# EAGLE design batteryholder2S4P_revD (EAGLE 9.5.1)

## Sheet 1 of 2
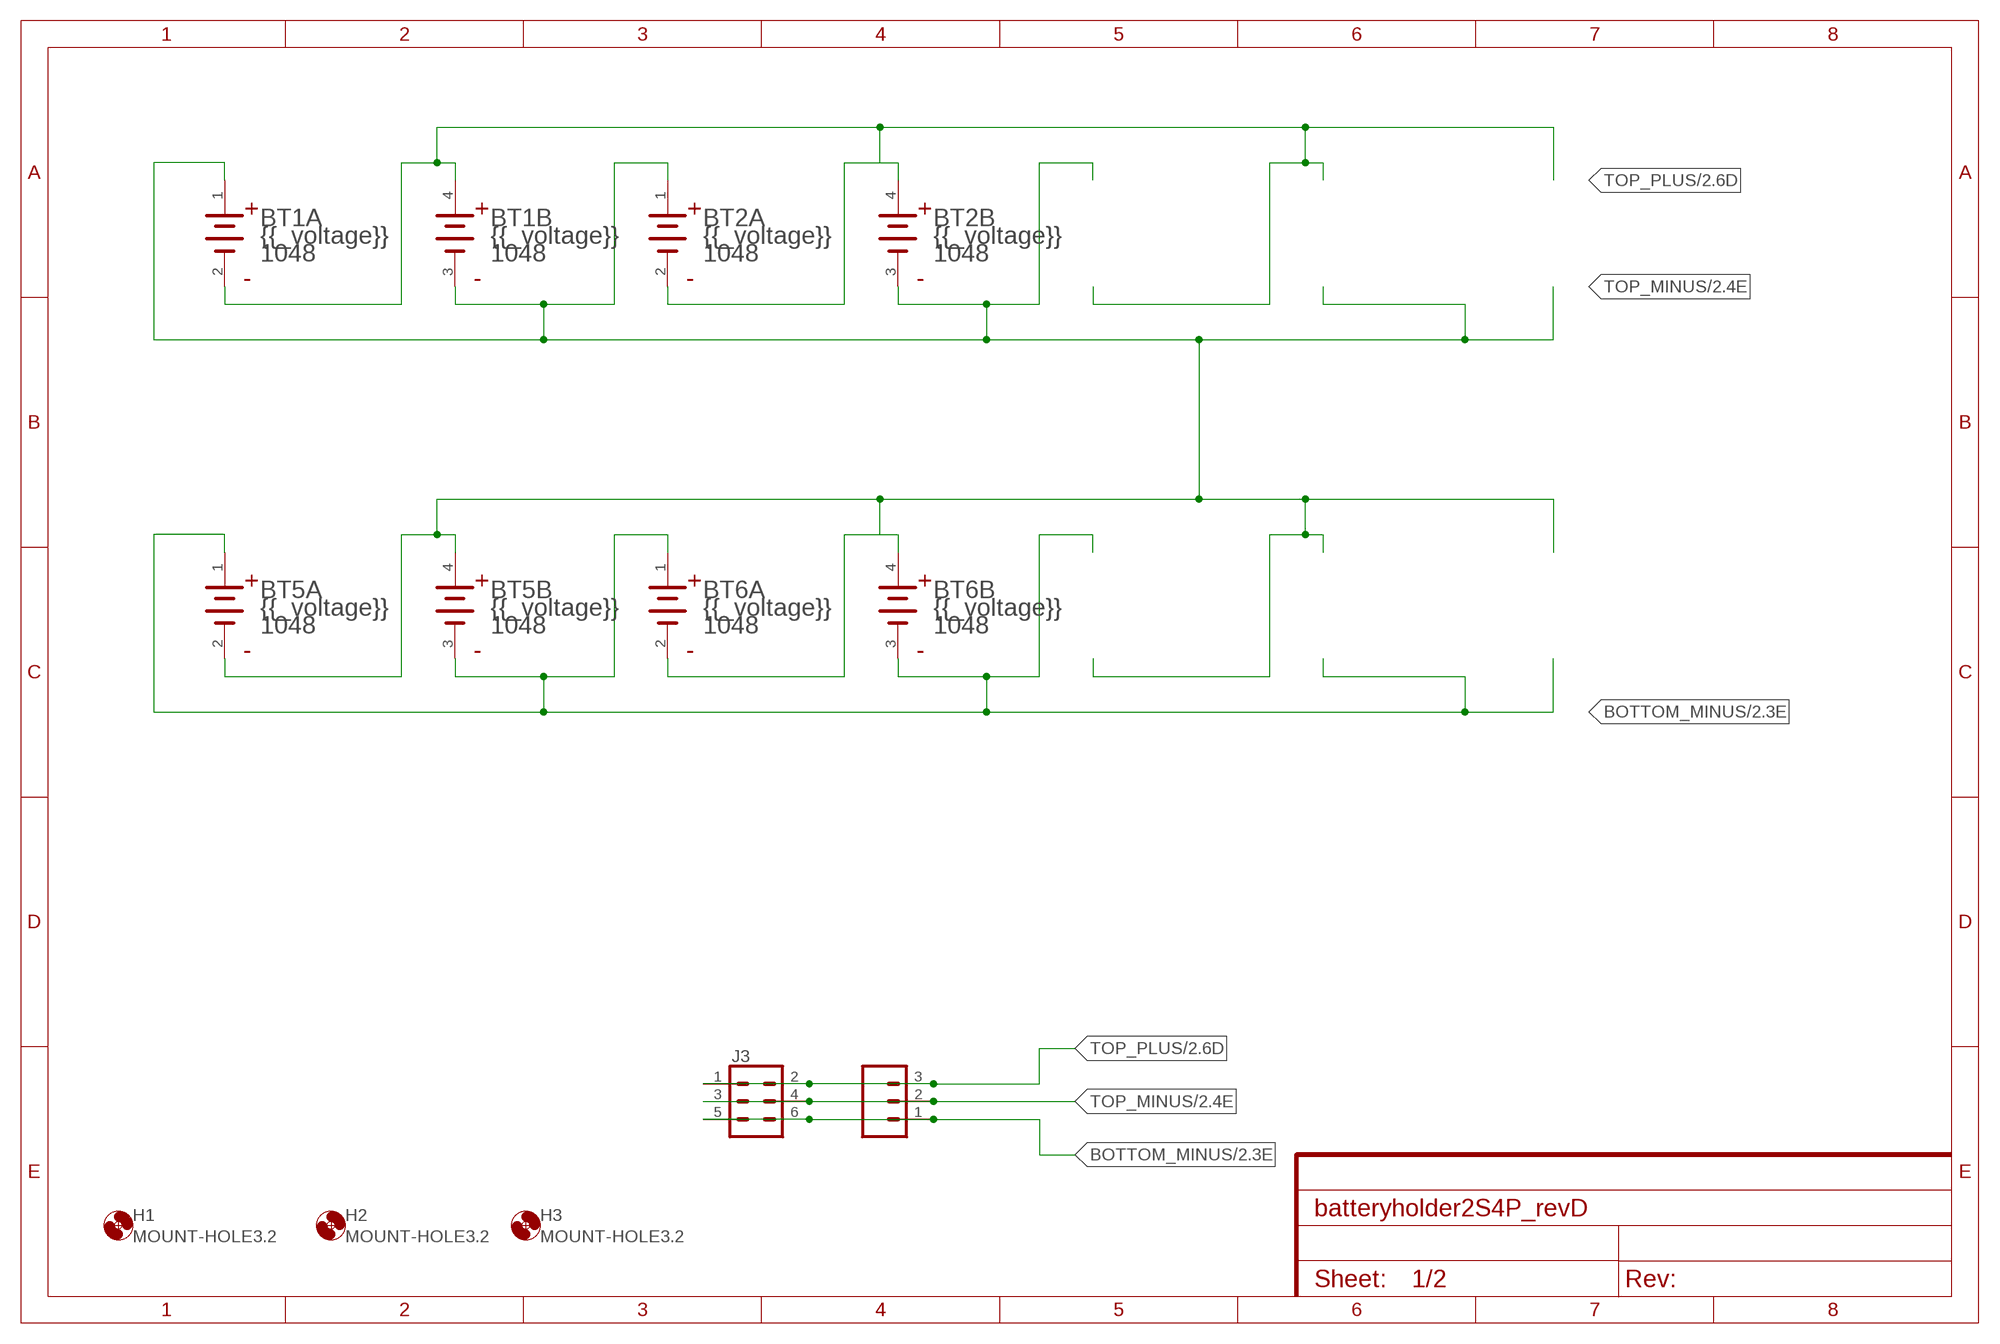
[diagram p0: schematic, sheet 1]

### Parts
BT1  KEYSTONE_1048KEYSTONE_1048_0_0  [KEYSTONE_1048_0]
BT2  KEYSTONE_1048KEYSTONE_1048_0_0  [KEYSTONE_1048_0]
BT5  KEYSTONE_1048KEYSTONE_1048_0_0  [KEYSTONE_1048_0]
BT6  KEYSTONE_1048KEYSTONE_1048_0_0  [KEYSTONE_1048_0]
H1  MOUNT-HOLE3.2  [3,2]
H2  MOUNT-HOLE3.2  [3,2]
H3  MOUNT-HOLE3.2  [3,2]
J1  CONN_03-SCREW-5MM  [SCREWTERMINAL-5MM-3]
J3  CONN_03X2SHROUD  [2X3-SHROUDED]

### Nets
BOTTOM_MINUS: BT5.1(A:1_ANODE) BT5.3(B:2_CATHODE) BT6.1(A:1_ANODE) BT6.3(B:2_CATHODE) J1.1 J3.5 J3.6 ; also sheet 2
TOP_MINUS: BT1.1(A:1_ANODE) BT1.3(B:2_CATHODE) BT2.1(A:1_ANODE) BT2.3(B:2_CATHODE) BT5.2(A:1_CATHODE) BT5.4(B:2_ANODE) BT6.2(A:1_CATHODE) BT6.4(B:2_ANODE) J1.2 J3.3 J3.4 ; also sheet 2
TOP_PLUS: BT1.2(A:1_CATHODE) BT1.4(B:2_ANODE) BT2.2(A:1_CATHODE) BT2.4(B:2_ANODE) J1.3 J3.1 J3.2 ; also sheet 2

## Sheet 2 of 2
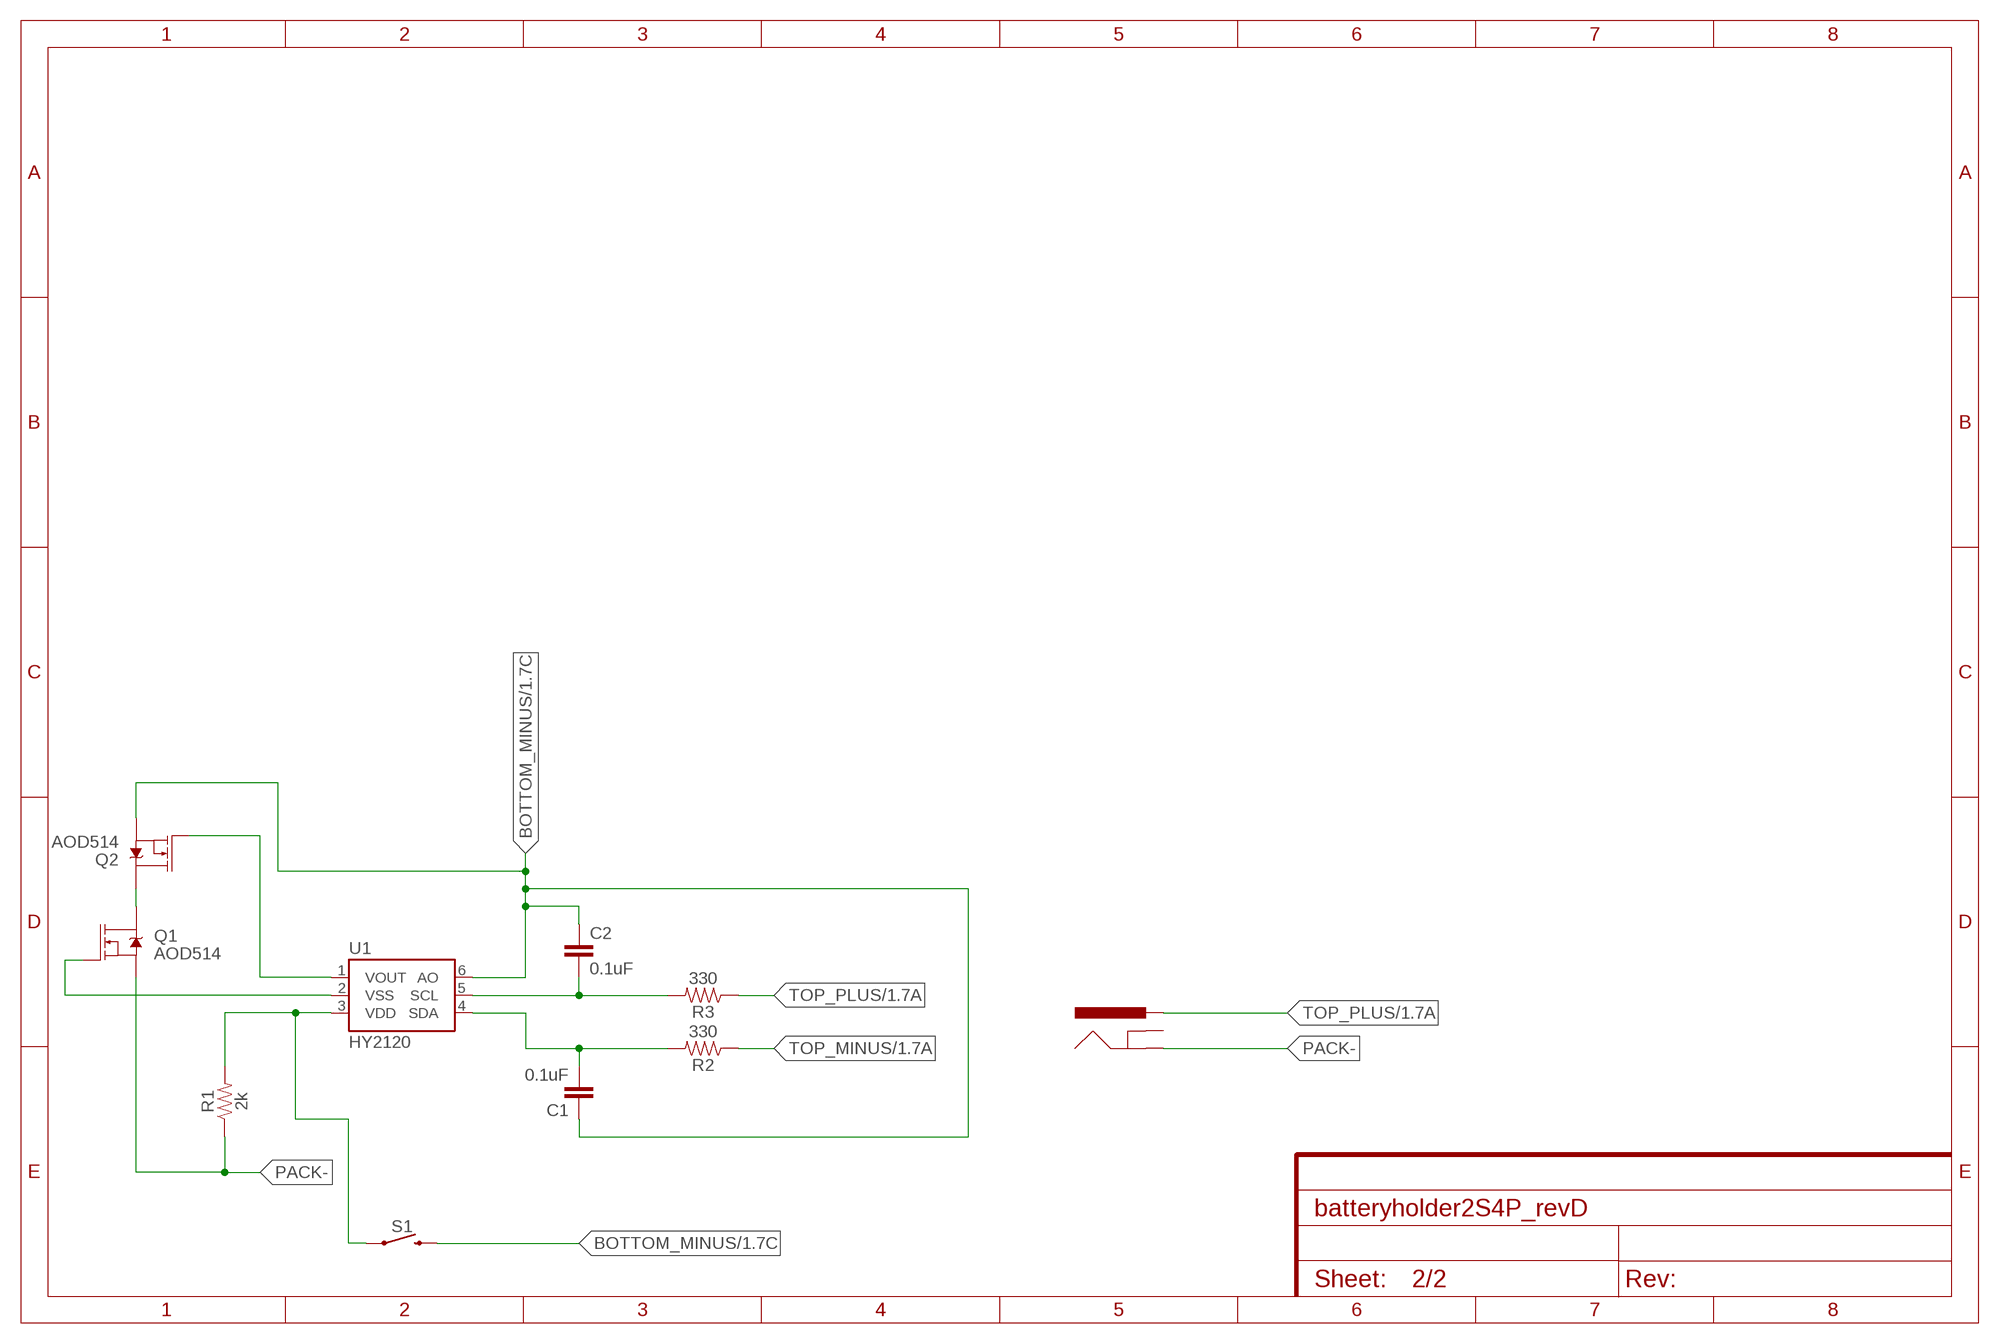
[diagram p1: schematic, sheet 2]

### Parts
C1  0.1uF  1.0UF-1206-50V-10%  [1206]
C2  0.1uF  1.0UF-1206-50V-10%  [1206]
J2  POWER_JACKPTH_BREAD  [POWER_JACK_PTH_BREAD]
Q1  AOD514  MOSFET-NCH-FDD8780  [DPAK]
Q2  AOD514  MOSFET-NCH-FDD8780  [DPAK]
R1  2k  RESISTOR1206  [1206]
R2  330  RESISTOR1206  [1206]
R3  330  RESISTOR1206  [1206]
S1  MOMENTARY-SWITCH-SPST-PTH-6.0MM  [TACTILE_SWITCH_PTH_6.0MM]
U1  HY2120  MCP4725SOT-23  [SOT23-6]

### Nets
BOTTOM_MINUS: C1.1 C2.1 Q2.3(S) S1.3 U1.6(AO) ; also sheet 1
N$1: Q2.1(G) U1.1(VOUT)
N$2: Q1.1(G) U1.2(VSS)
N$3: R1.2 S1.1 U1.3(VDD)
N$4: C2.2 R3.2 U1.5(SCL)
N$5: C1.2 R2.2 U1.4(SDA)
N$6: Q1.4(D) Q2.4(D)
PACK-: J2.GND Q1.3(S) R1.1
TOP_MINUS: R2.1 ; also sheet 1
TOP_PLUS: J2.PWR R3.1 ; also sheet 1
Unconnected: J2.GNDBREAK

## Library data of the parts
BT1 BT2 BT5 BT6 = Keystone - 1048:KEYSTONE_1048: SMT Holder for Dual 18650 Batteries; CENTROID_NOT_SPECIFIED: No; CONN_ORIENTATION: Horizontal; CONTACT_MATERIAL: Gold,Nickel; DATASHEET: https://www.keyelco.com/userAssets/file/M65p27.pdf; DEVICE_CLASS_L1: Connectors; DEVICE_CLASS_L2: unset; DEVICE_CLASS_L3: unset; DIGIKEY_DESCRIPTION: BATT HOLDER 18650 2 CELL SMD TAB; DIGIKEY_PART_NUMBER: 36-1048-ND; FOOTPRINT_URL: https://www.keyelco.com/product-pdf.cfm?p=920; HEIGHT: 0.595inch; LEAD_FREE: yes; MF: Keystone; MFG_PACKAGE_IDENT: 1048; MFG_PACKAGE_IDENT_DATE: 0; MFG_PACKAGE_IDENT_REV: 0; MOUSER_DESCRIPTION: Battery holder SMD Dimensions L x W x H: 86 x 39.78 x 14.86 mm Suitable for: 2 x 18650; MOUSER_PART_NUMBER: 534-1048; MPN: 1048; NUMBER_OF_CONTACTS: 2; PACKAGE: SMT_BTTHLDR_18650_DUAL; PREFIX: BT; ROHS: yes; TEMPERATURE_RANGE_HIGH: +145°C; TEMPERATURE_RANGE_LOW: -50°C; VERIFICATION_VERSION: 0.0.0.1
C1 C2 = SparkFun-Capacitors:1.0UF: 1µF ceramic capacitors A capacitor is a passive two-terminal electrical component used to store electrical energy temporarily in an electric field.; PROD_ID: CAP-09822; VALUE: 1.0uF
H1-H3 = holes:MOUNT-HOLE: MOUNTING HOLE with drill center marker
J1 = SparkFun-Connectors:CONN_03: Multi connection point. Often used as Generic Header-pin footprint for 0.1 inch spaced/style header connections On any of the 0.1 inch spaced packages, you can populate with these: Break Away Headers - Straight <https://www.sparkfun.com/products/116> (PRT-00116) Break Away Male Headers - Right Angle <https://www.sparkfun.com/products/553> (PRT-00553) Female Headers <https://www.sparkfun.com/products/115> (PRT-00115) Break Away Headers - Machine Pin <https://www.sparkfun.com/products/117> (PRT-00117) Break Away Female Headers - Swiss Machine Pin <https://www.sparkfun.com/products/743> (PRT-00743) Stackable Header - 3 Pin (Female, 0.1") <https://www.sparkfun.com/products/13875> (PRT-13875) For SCREWTERMINALS and SPRING TERMINALS visit here: Screw Terimnals on SparkFun.com <https://www.sparkfun.com/search/results?term=Screw+Terminals> (5mm/3.5mm/2.54mm spacing) This device is also useful as a general connection point to wire up your design to another part of your project. Our various solder wires solder well into these plated through hole pads. Hook-Up Wire - Assortment (Stranded, 22 AWG) <https://www.sparkfun.com/products/11375> (PRT-11375) Hook-Up Wire - Assortment (Solid Core, 22 AWG) <https://www.sparkfun.com/products/11367> (PRT-11367) View the entire wire category on our website here <https://www.sparkfun.com/categories/141> Special notes: Molex polarized connector foot print use with SKU : PRT-08232 with associated crimp pins and housings.; PROD_ID: CONN-10134; SF_SKU: PRT-08433
J2 = SparkFun-Connectors:POWER_JACK: Power Jack Connector This is the standard 5.5mm barrel jack for power. The PTH is the most common, proven, reliable, footprint. The Slot footprint only works if the mill layer is transmitted to the PCB fab house so be warned. Here are the connectors we sell at SparkFun: DC Barrel Power Jack/Connector <https://www.sparkfun.com/products/119> (PRT-00119) DC Barrel Power Jack/Connector (SMD) <https://www.sparkfun.com/products/12748> (PRT-12748) DC Barrel Jack Adapter - Breadboard Compatible <https://www.sparkfun.com/products/10811> (PRT-10811) It is used on this SparkFun product (and many, many others): SparkFun RedBoard - Programmed with Arduino <https://www.sparkfun.com/products/12757> (DEV-12757) Also, if you need a mating power supply or connector, please check these out: Wall Adapter Power Supply - 9VDC 650mA <https://www.sparkfun.com/products/298> (TOL-00298) DC Barrel Jack Adapter - Male <https://www.sparkfun.com/products/10287> (PRT-10287); PROD_ID: PRT-10811
J3 = SparkFun-Connectors:CONN_03X2: Multi connection point. Often used as Generic Header-pin footprint for 0.1 inch spaced/style header connections You can populate with any combo of single row headers, but if you'd like an exact match, check these: Header - 2x3 (Male, 0.1") <https://www.sparkfun.com/products/12807> (PRT-12807) Header - 2x3 (Female, 0.1") <https://www.sparkfun.com/products/13010> (PRT-13010) 2x3 Pin Shrouded Header <https://www.sparkfun.com/products/10877> (PRT-10877) On any of the 0.1 inch spaced packages, you can populate with these: Break Away Headers - Straight <https://www.sparkfun.com/products/116> (PRT-00116) Break Away Male Headers - Right Angle <https://www.sparkfun.com/products/553> (PRT-00553) Female Headers <https://www.sparkfun.com/products/115> (PRT-00115) Break Away Headers - Machine Pin <https://www.sparkfun.com/products/117> (PRT-00117) Break Away Female Headers - Swiss Machine Pin <https://www.sparkfun.com/products/743> (PRT-00743) Special note: the shrouded connector mates well with our 3x2 ribbon cables: Ribbon Crimp Connector - 6-pin (2x3, Female) <https://www.sparkfun.com/products/10651> (PRT-10651) Ribbon Cable - 6 wire (15ft) <https://www.sparkfun.com/products/10646> (PRT-10646); PROD_ID: CONN-10681; SF_ID: PRT_10877
Q1 Q2 = SparkFun-DiscreteSemi:MOSFET-NCH: N-channel MOSFETs Voltage controlled devices that allow control of high current outputs. SparkFun Products: SparkFun OpenScale <https://www.sparkfun.com/products/13261> SparkFun Digital Sandbox <https://www.sparkfun.com/products/12651> SparkFun Monster Moto Shield <https://www.sparkfun.com/products/10182> SparkFun MOSFET Power Controller <https://www.sparkfun.com/products/11214>; PROD_ID: TRANS-09984; VALUE: 35A/25V/8.5mΩ
R1-R3 = SparkFun-Resistors:RESISTOR: Generic Resistor Package
S1 = SparkFun-Switches:MOMENTARY-SWITCH-SPST: Momentary Switch (Pushbutton) - SPST Normally-open (NO) SPST momentary switches (buttons, pushbuttons). Variants PTH-12MM - 12mm square, through-hole Momentary Pushbutton Switch - 12mm Square <https://www.sparkfun.com/products/9190> (COM-09190) PTH-6.0MM, PTH-6.0MM-KIT - 6.0mm square, through-hole Mini Pushbutton Switch <https://www.sparkfun.com/products/97> (COM-00097) KIT package intended for soldering kit's - only one side of pads' copper is exposed. PTH-RIGHT-ANGLE-KIT - Right-angle, through-hole Right Angle Tactile Button <https://www.sparkfun.com/products/10791> - Used on SparkFun BigTime Watch Kit <https://www.sparkfun.com/products/11734> SMD-12MM - 12mm square, surface-mount Tactile Button - SMD (12mm) <https://www.sparkfun.com/products/12993> (COM-12993) Used on SparkFun PicoBoard <https://www.sparkfun.com/products/11888> SMD-4.5MM - 4.5mm Square Trackball Switch Used on SparkFun Blackberry Trackballer Breakout <https://www.sparkfun.com/products/13169> SMD-4.6MMX2.8MM - 4.60mm x 2.80mm, surface mount Used on SparkFun SAMD21 Mini Breakout <https://www.sparkfun.com/products/13664> SMD-5.2MM, SMD-5.2-REDUNDANT - 5.2mm square, surface-mount Mini Pushbutton Switch - SMD <https://www.sparkfun.com/products/8720> (COM-08720) Used on Arduino Pro Mini <https://www.sparkfun.com/products/11114> REDUNDANT package connects both switch circuits together SMD-6.0X3.5MM - 6.0 x 3.5mm, surface mount Momentary Reset Switch SMD <https://www.sparkfun.com/products/8229> (COM-08229) SMD-6.2MM-TALL - 6.2mm square, surface mount Tactile Button - SMD (6mm) <https://www.sparkfun.com/products/12992> Used on SparkFun Digital Sandbox <https://www.sparkfun.com/products/12651> SMD-RIGHT-ANGLE - Right-angle, surface mount Used on SparkFun Block for Intel® Edison - Arduino <https://www.sparkfun.com/products/13036>; PROD_ID: SWCH-08441; SF_SKU: COM-00097
U1 = SparkFun-IC-Conversion:MCP4725: MCP4725 DAC Microchip 12-bit I2C DAC, SOT23-6 Datasheet <https://cdn.sparkfun.com/datasheets/BreakoutBoards/MCP4725_2009.pdf> SparkFun Products SparkFun I2C DAC Breakout - MCP4725 <https://www.sparkfun.com/products/12918> (BOB-12918); PROD_ID: IC-08886; VALUE: MCP4725

## Board
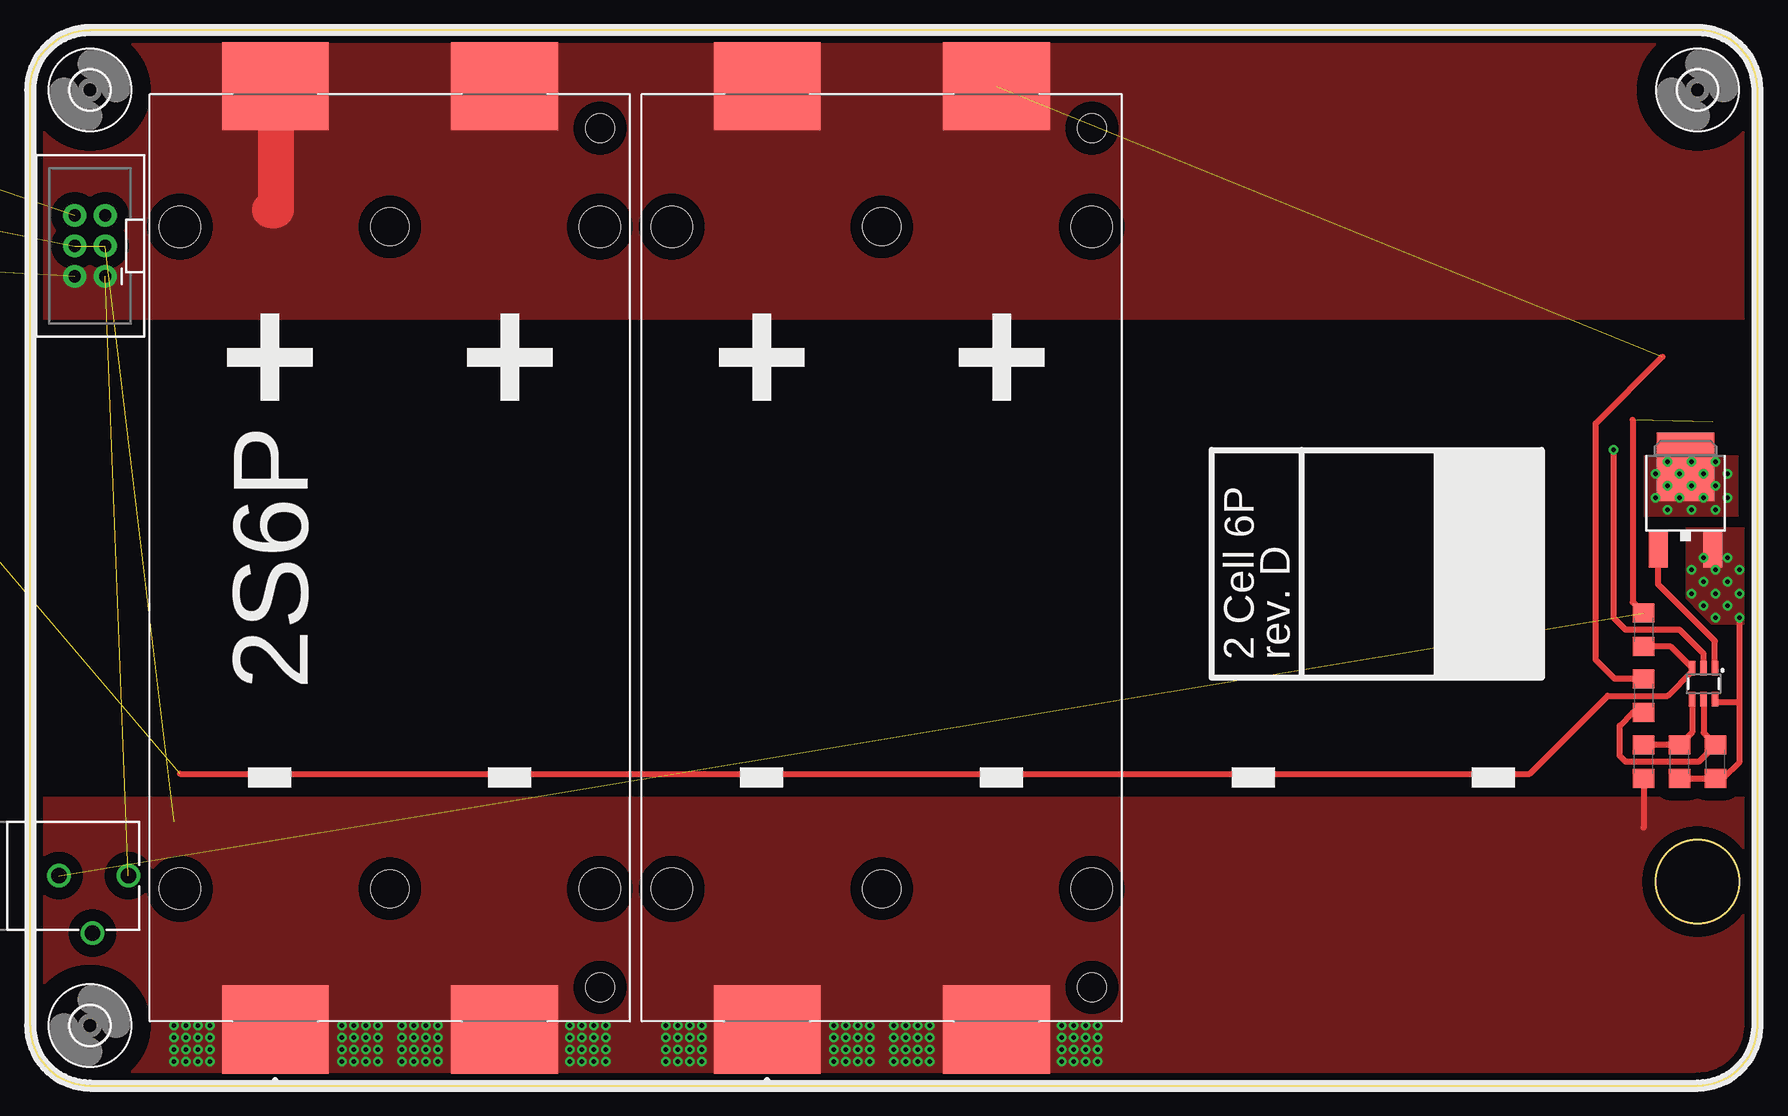
[diagram p2: board, top side]
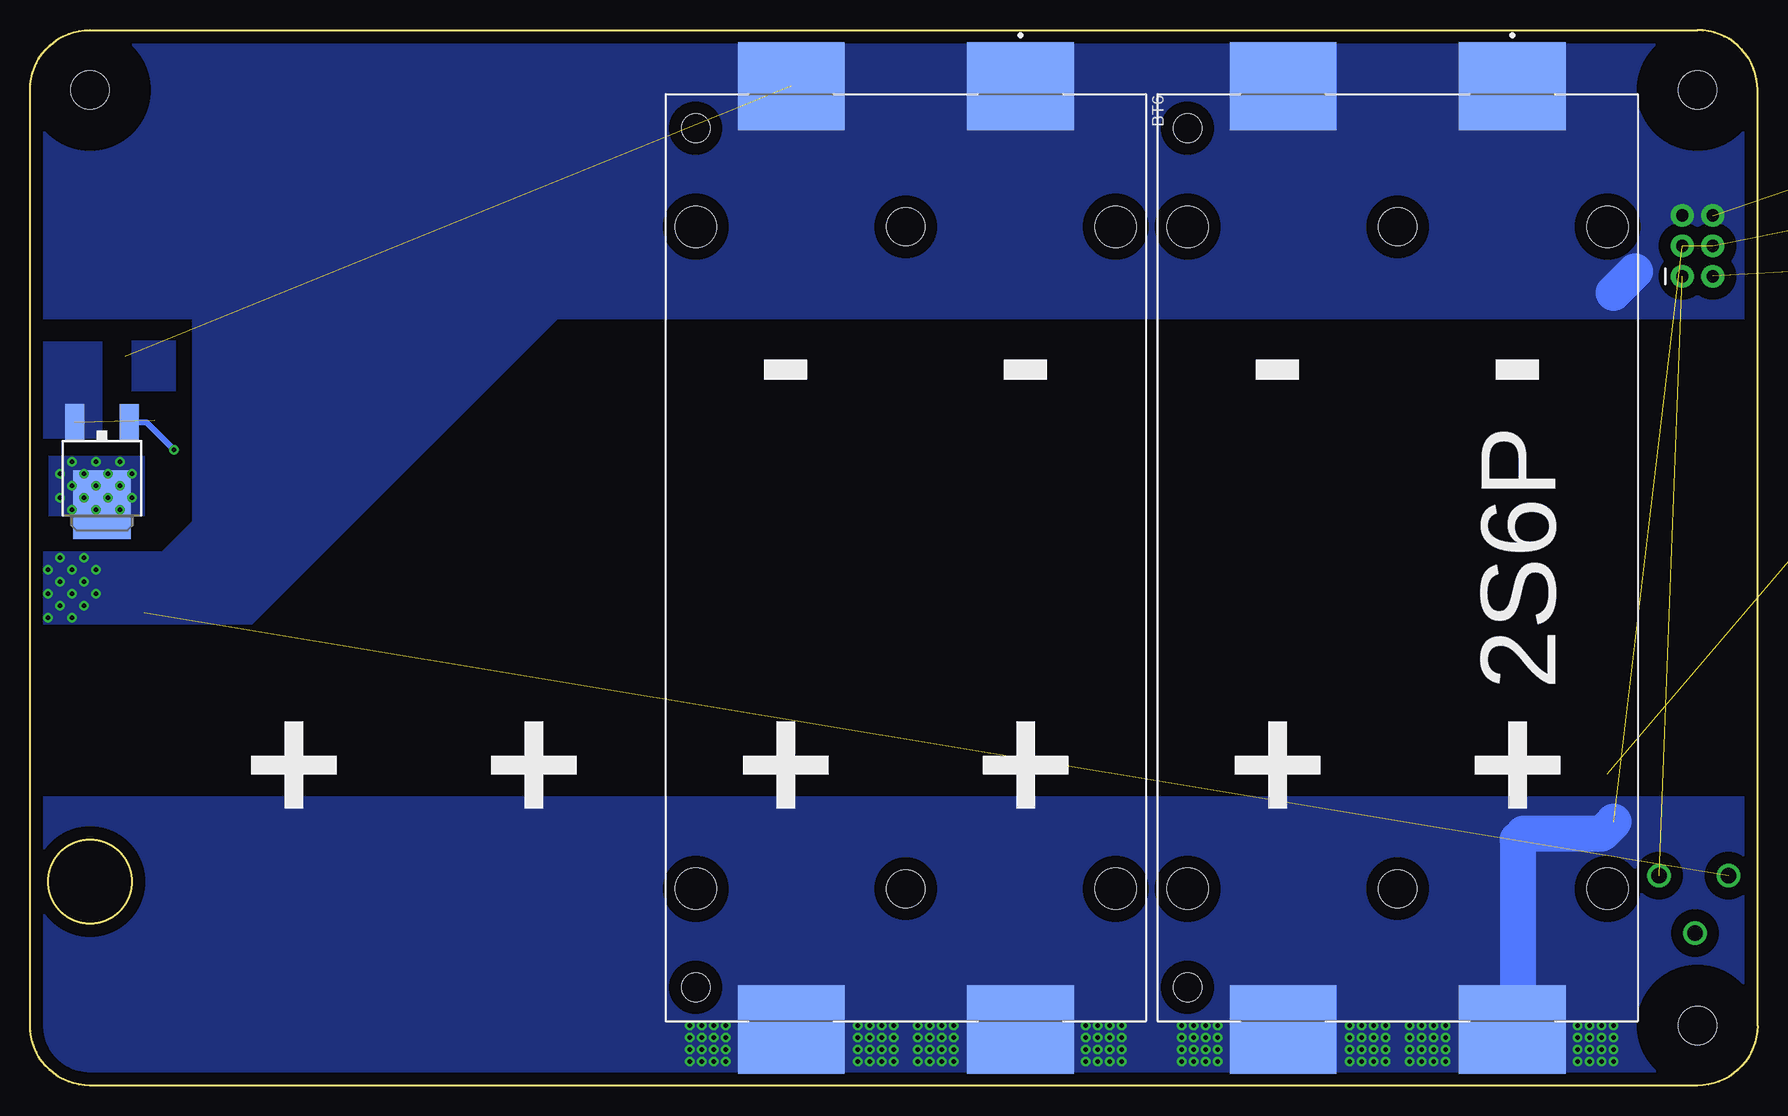
[diagram p3: board, bottom side, seen from below]

Size 144 x 88 mm. Coordinates in mm from the lower left corner, seen from the top.
Outline: 0,76 0,83 arc-90 5,88 139,88 arc-90 144,83 144,5 arc-90 139,0 5,0 arc-90 0,5 0,76.1
Outline: circle at 139,17 radius 3.5
Copper layers (1*16): Top 0.035mm / dielectric 1.5mm / Bottom 0.035mm
Design rules "default": minimum track width 6mil, minimum drill 0.35mm, track to track 6mil, track to pad 6mil, pad to pad 6mil, via to via 6mil, smd to smd 6mil, copper to edge 40mil, drill to drill 6mil, minimum pad ring 10mil, minimum via ring 8mil, stop-mask expansion 4mil, vias tented up to drill 0mil, thermal gap 10mil

### Footprints (pad centres in the part's own frame; a part is rotated, then mirrored left to right if it is on the bottom)
KEYSTONE_1048_0 = smd 7.34 x 8.89: 1 -39.33,9.555; 2 39.33,9.555; 3 -39.33,-9.555; 4 39.33,-9.555 | hole 3.45: 27.6,17.505; -27.6,-17.505 | hole 2.39: 35.82,-17.505 | hole 3.17: 27.6,0; -27.6,0
1206 = smd 1.6 x 1.8: 1 -1.4,0; 2 1.4,0
3,2 = hole 3.2: 0,0
SCREWTERMINAL-5MM-3 = drill 1.3 pad 2.413 square: 1 0,0 | drill 1.3 pad 2.413: 2 5,0; 3 10,0
POWER_JACK_PTH_BREAD = drill 1.3: GND 0,7.9; GNDBREAK 4.8,10.7; PWR 0,13.7
2X3-SHROUDED = drill 1.016 pad 1.88: 1 -1.27,2.54; 2 1.27,2.54; 3 -1.27,0; 4 1.27,0; 5 -1.27,-2.54; 6 1.27,-2.54
DPAK = smd 1.6 x 3: 1 -2.28,-5.31; 3 2.28,-5.31 | smd 4.826 x 5.715: 4 0,1.588
TACTILE_SWITCH_PTH_6.0MM = drill 1.016 pad 1.88: 1 -3.251,2.261; 2 3.251,2.261; 3 -3.251,-2.261; 4 3.251,-2.261
SOT23-6 = smd 0.55 x 1.2: 1 0.95,1.3; 2 0,1.3; 3 -0.95,1.3; 4 -0.95,-1.3; 5 0,-1.3; 6 0.95,-1.3

### Placement (x,y rotation side)
BT1  30,44 90 top
BT2  71,44 90 top
BT5  30,44 270 bottom
BT6  71,44 270 bottom
C1  137.5,27 90 top
C2  140.5,27 90 top
H1  5,83 0 top
H2  5,5 0 top
H3  139,83 0 top
J1  -13.7,78.5 270 top  (outside the outline)
J2  -5.5,17.5 270 top
J3  5,70 180 top
Q1  138,50 180 bottom
Q2  138,50 0 top
R1  134.5,38 270 top
R2  134.5,27 90 top
R3  134.5,32.5 270 top
S1  -16,53.5 270 top  (outside the outline)
U1  139.5,33.5 0 top

### Tracks (layer width: path | path; a pad name or v marks a point on that pad's centre or on a via)
BOTTOM_MINUS  (via drill 0.35)  (2 unrouted)
  Top 0.5: 142.5,32 142.5,27 141.1,25.6 C2.1 C1.1 | U1.6 140.65,32 142.5,32 | 142.5,32 v142.5,39
  Bottom 3: 12,66.1 10.23,67.87
  other vias: 142.5,43 142.5,41 141.5,40 141.5,42 141.5,44 140.5,43 140.5,41 140.5,39 139.5,40 139.5,42 139.5,44 138.5,43 138.5,41
  pour Bottom (isolate 1, no thermals): 0,88 0,64 144,64 144,88
  pour Top (isolate 0.5, no thermals): 144,46.5 138,46.5 138,42 138,38.5 144,38.5
  pour Bottom (no thermals): 144,38.5 125.5,38.5 100,64 100,65 130.5,65 130.5,47 133,44.5 144,44.5
N$1
  Top 0.5: U1.1 140.45,37.05 135.72,41.78 Q2.1
N$2  (via drill 0.35)
  Top 0.5: U1.2 139.5,36 137.5,38 133,38 132,39 v132,53
  Bottom 0.5: v132,53 134.31,55.31 Q1.1
N$3  (1 unrouted)
  Top 0.5: R1.2 136.75,36.6 U1.3 138.55,34.55 136.5,32.5 131.5,32.5 125,26 12.51,26
N$4
  Top 0.5: U1.5 139.5,29.4 C2.2 139.1,27 133,27 132.5,27.5 132.5,30 133.6,31.1 R3.2
N$5
  Top 0.5: R2.2 C1.2 138.55,29.45 U1.4
N$6  (via drill 0.35)
  other vias: 141.5,49 141.5,51 140.5,52 140.5,50 140.5,48 139.5,51 139.5,49 138.5,48 138.5,50 138.5,52 137.5,51 137.5,49 136.5,48 136.5,50 136.5,52 135.5,51 135.5,49
  pour Top (no thermals): 142.4,52.5 134.5,52.5 134.5,47.5 142.4,47.5
  pour Bottom (no thermals): 134.5,52.5 134.5,47.5 142.4,47.5 142.4,52.5
PACK-  (2 unrouted)
  Top 0.5: 133.6,55.5 133.6,40.3 R1.1
  pour Bottom (no thermals): 144,54 138,54 138,62 144,62
TOP_MINUS  (via drill 0.35)  (3 unrouted)
  Top 0.5: R2.1 134.5,21.5
  Bottom 3: 12,22 13,21 19.5,21 20,20.5 20,3.5
  other vias: 26,2 26,3 26,4 26,5 27,2 27,3 27,4 27,5 28,2 28,3 28,4 28,5 29,2 29,3 29,4 29,5 12,2 12,3 12,4 12,5 13,2 13,3 13,4 13,5 14,2 14,3 14,4 14,5 15,2 15,3 15,4 15,5 31,2 31,3 31,4 31,5 32,2 32,3 32,4 32,5 33,2 33,3 33,4 33,5 34,2 34,3 34,4 34,5 45,2 45,3 45,4 45,5 46,2 46,3 46,4 46,5 47,2 47,3 47,4 47,5 48,2 48,3 48,4 48,5 53,2 53,3 53,4 53,5 54,2 54,3 54,4 54,5 55,2 55,3 55,4 55,5 56,2 56,3 56,4 56,5 72,2 72,3 72,4 72,5 73,2 73,3 73,4 73,5 74,2 74,3 74,4 74,5 75,2 75,3 75,4 75,5 86,2 86,3 86,4 86,5 87,2 87,3 87,4 87,5 88,2 88,3 88,4 88,5 89,2 89,3 89,4 89,5 67,2 67,3 67,4 67,5 68,2 68,3 68,4 68,5 69,2 69,3 69,4 69,5 70,2 70,3 70,4 70,5
  pour Top (isolate 1, no thermals): 0,0 0,24 144,24 144,0
  pour Bottom (isolate 1, no thermals): 0,0 0,24 144,24 144,0
TOP_PLUS  (3 unrouted)
  Top 0.5: R3.1 132.1,33.9 130.5,35.5 130.5,55.2 136.07,60.77
  Top 3: 20,73 20.5,73 20.5,83.28 BT1.2
  pour Top (isolate 1, no thermals): 0,88 0,64 144,64 144,88
  pour Top (isolate 1, rank 2, no thermals): 144,66.5 123.75,66.5 123.75,64.25 144,64.25
  pour Bottom (isolate 1, no thermals): 135.5,62.1 131.9,62.1 131.9,57.9 135.5,57.9

### Text on the board
tPlace: + | + | + | + | G | 2 | 2S6P | 2 Cell 6P | rev. D | - | - | - | - | - | - | reset | rev. D
bPlace: - | - | - | - | 2S6P | + | + | + | + | + | +